# EAGLE design litterbox (EAGLE 9.5.2)
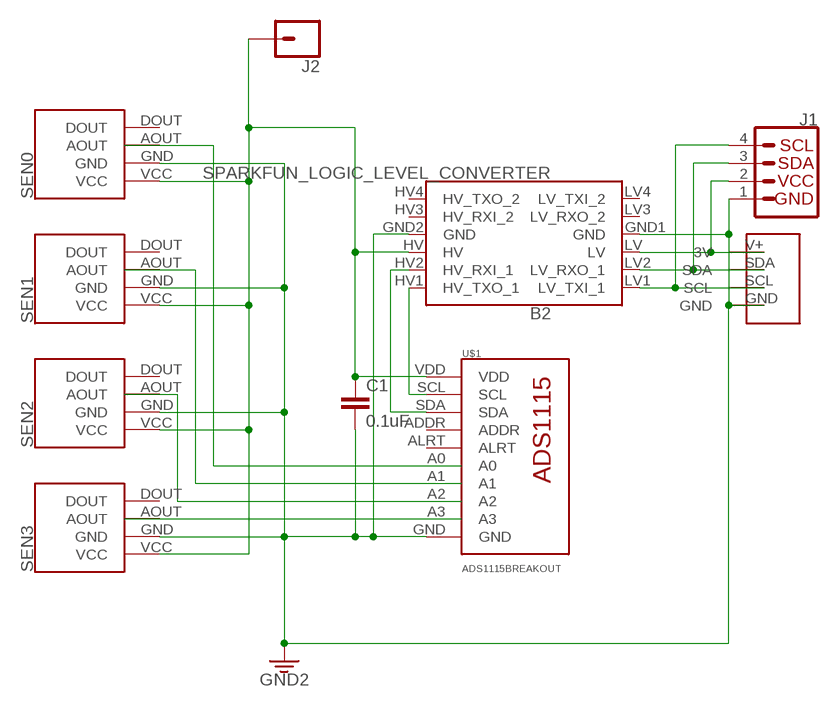
[diagram p0: schematic, sheet 1]

## Parts
B2  SPARKFUN_LOGIC_LEVEL_CONVERTER  [SPARKFUN_LOGIC_LEVEL_CONVERTER]
C1  0.1uF  0.1UF-KIT-EZ-50V-20%  [CAP-PTH-SMALL-KIT]
J1  QWIIC_CONNECTORJS-1MM  [1X04_1MM_RA]
J2  CONN_01  [1X01]
SEN0  MQ-SENSOR-BREAKOUT  [MQ-SENSOR-BREAKOUT]
SEN1  MQ-SENSOR-BREAKOUT  [MQ-SENSOR-BREAKOUT]
SEN2  MQ-SENSOR-BREAKOUT  [MQ-SENSOR-BREAKOUT]
SEN3  MQ-SENSOR-BREAKOUT  [MQ-SENSOR-BREAKOUT]
U$1  ADS1115BREAKOUT  [ADS1115BREAKOUT]
U$2  I2CHEADER  [I2CHEADER]

## Nets
3V3 [Power]: B2.LV J1.2(VCC) U$2.V+(3V)
5V [Power]: B2.HV C1.1 J2.1 SEN0.VCC SEN1.VCC SEN2.VCC SEN3.VCC U$1.VDD
GND [Power]: B2.GND1(GND) B2.GND2(GND) C1.2 J1.1(GND) SEN0.GND SEN1.GND SEN2.GND SEN3.GND U$1.GND U$2.GND ; supply symbol labelled GND2
N$9: B2.HV2(HV_RXI_1) U$1.SDA
N$11: B2.LV1(LV_TXI_1) J1.4(SCL) U$2.SCL
N$12: B2.HV1(HV_TXO_1) U$1.SCL
N$13: B2.LV2(LV_RXO_1) J1.3(SDA) U$2.SDA
SEN0A: SEN3.AOUT U$1.A3
SEN1A: SEN2.AOUT U$1.A2
SEN3A: SEN1.AOUT U$1.A1
SEN4A: SEN0.AOUT U$1.A0
Unconnected: B2.HV3(HV_RXI_2) B2.HV4(HV_TXO_2) B2.LV3(LV_RXO_2) B2.LV4(LV_TXI_2) SEN0.DOUT SEN1.DOUT SEN2.DOUT SEN3.DOUT U$1.ADDR U$1.ALRT

## Library data of the parts
B2 = SparkFun-Boards:SPARKFUN_LOGIC_LEVEL_CONVERTER: SparkFun Logic Level Converter -Bi-Directional This is the mechnical outline for the 3.3V - 5V bi directional logic level converter. *Note, the "LOCK" Package has the header pins staggered by an offset of 5 mils (off center line), so that when you slide a row of standard 0.1" headers into the PTH pads, it will hold position vertically. See the follwing turorial for more information on this type of special footprints: Sneaky Footprints <https://www.sparkfun.com/tutorials/114> SparkFun Products: SparkFun Logic Level Converter - Bi-Directional <https://www.sparkfun.com/products/12009>
C1 = SparkFun-Capacitors:0.1UF: 0.1µF ceramic capacitors A capacitor is a passive two-terminal electrical component used to store electrical energy temporarily in an electric field.; PROD_ID: CAP-08370
J1 = SparkFun-Connectors:QWIIC_CONNECTOR: SparkFun I2C Standard Qwiic Connector An SMD 1mm pitch JST connector makes it easy and quick (get it? Qwiic?) to connect I2C devices to each other. The Qwiic system <http://www.sparkfun.com/qwiic> enables fast and solderless connection between popular platforms and various sensors and actuators. We carry 200mm <https://www.sparkfun.com/products/14204>, 100mm <https://www.sparkfun.com/products/14205>, 50mm <https://www.sparkfun.com/products/14206>, and breadboard friendly <https://www.sparkfun.com/products/14207> Qwiic cables. We also offer 10 pcs strips <https://www.sparkfun.com/products/14323> the SMD connectors.
J2 = SparkFun-Connectors:CONN_01: Single connection point. Often used as Generic Header-pin footprint for 0.1 inch spaced/style header connections On any of the 0.1 inch spaced packages, you can populate with these: Break Away Headers - Straight <https://www.sparkfun.com/products/116> (PRT-00116) Break Away Male Headers - Right Angle <https://www.sparkfun.com/products/553> (PRT-00553) Female Headers <https://www.sparkfun.com/products/115> (PRT-00115) Break Away Headers - Machine Pin <https://www.sparkfun.com/products/117> (PRT-00117) Break Away Female Headers - Swiss Machine Pin <https://www.sparkfun.com/products/743> (PRT-00743) This device is also useful as a general connection point to wire up your design to another part of your project. Our various solder wires solder well into these plated through hole pads. Hook-Up Wire - Assortment (Stranded, 22 AWG) <https://www.sparkfun.com/products/11375> (PRT-11375) Hook-Up Wire - Assortment (Solid Core, 22 AWG) <https://www.sparkfun.com/products/11367> (PRT-11367) View the entire wire category on our website here <https://www.sparkfun.com/categories/141> Special notes: SMTSO-256-ET is a "flush mount" nut for a 4-40 screw. We mostly use this on specialty testbeds; it is a nice way to connect hardware to your PCB at an adjustable hieght. Also note, the SNAP packages are for using a snappable style connector. We sell a baggie of snaps and they are also used on two LilyPad designs: Snap Assortment - 30 pack (male and female) <https://www.sparkfun.com/products/11347> (DEV-11347) LilyPad Arduino SimpleSnap <https://www.sparkfun.com/products/10941> (DEV-10941) LilyPad SimpleSnap Protoboard <https://www.sparkfun.com/products/10940> (DEV-10940)
SEN0 SEN1-SEN3 = LOLIN32:MQ-SENSOR-BREAKOUT: MQ-series gas sensor breakout board. Pinout may vary.
U$1 = LOLIN32:ADS1115BREAKOUT: ADS1115 I2C 4 channel ADC
U$2 = LOLIN32:I2CHEADER

## Board
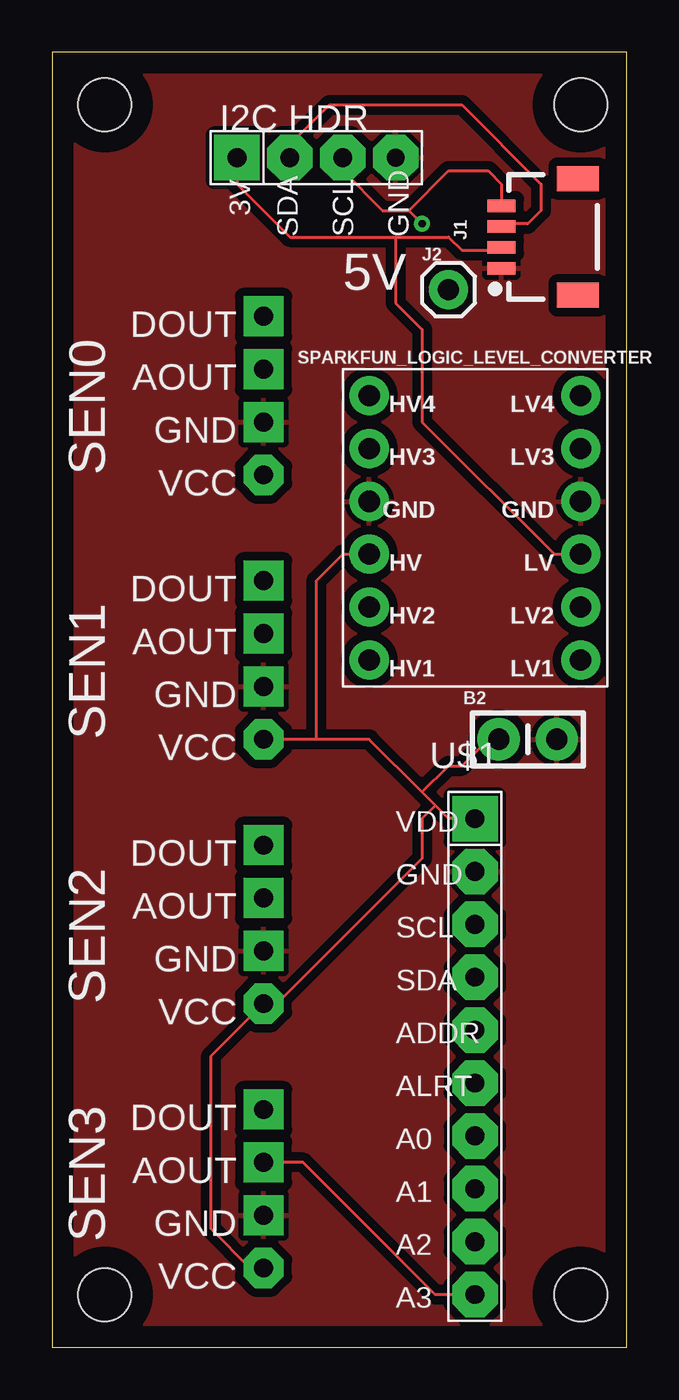
[diagram p1: board, top side]
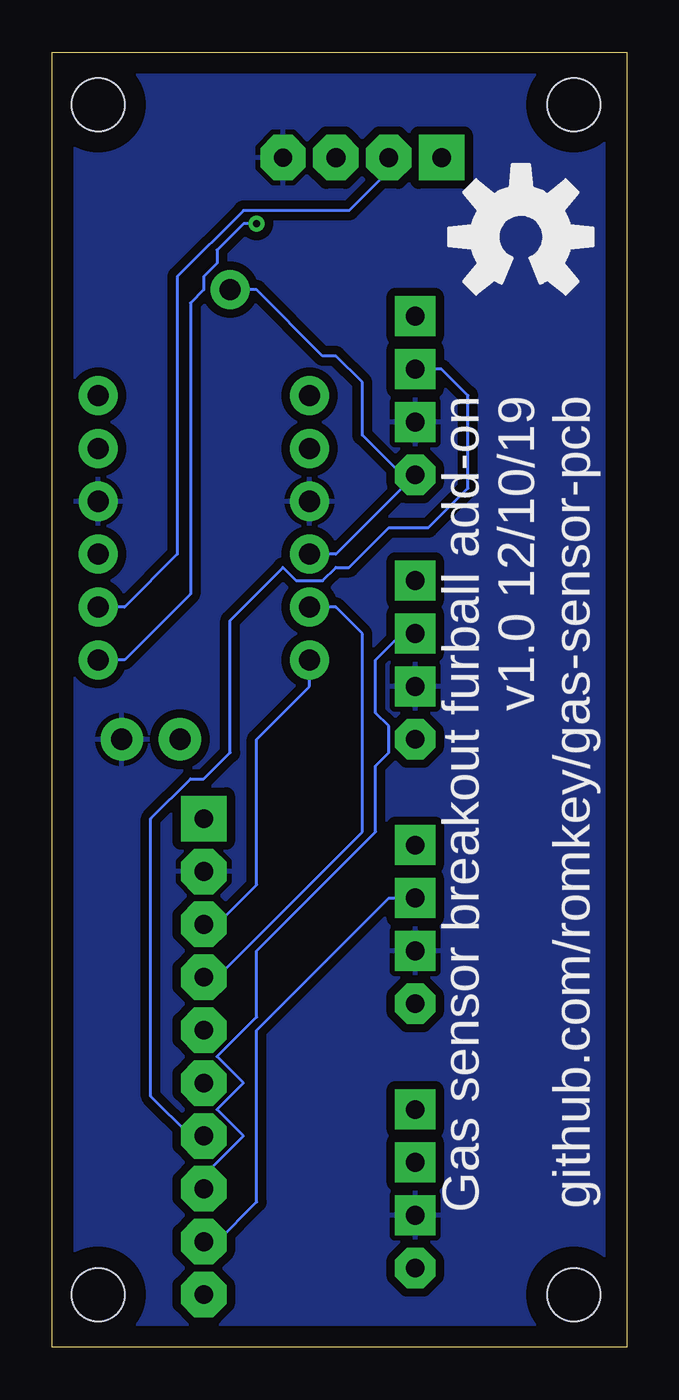
[diagram p2: board, bottom side, seen from below]

Size 27.61 x 62.22 mm. Coordinates in mm from the lower left corner, seen from the top.
Outline: 0,0 27.61,0 27.61,62.22 0,62.22 0,0
Copper layers (1*16): Top 0.035mm / dielectric 1.5mm / Bottom 0.035mm
Design rules "default": minimum track width 6mil, minimum drill 0.35mm, track to track 6mil, track to pad 6mil, pad to pad 6mil, via to via 6mil, smd to smd 6mil, copper to edge 40mil, drill to drill 6mil, minimum pad ring 10mil, minimum via ring 8mil, stop-mask expansion 4mil, vias tented up to drill 0mil, thermal gap 10mil
Holes 2.54 mm at 2.54,2.54 2.54,59.69 25.4,2.54 25.4,59.69

### Footprints (pad centres in the part's own frame; a part is rotated, then mirrored left to right if it is on the bottom)
SPARKFUN_LOGIC_LEVEL_CONVERTER = drill 1.016 pad 1.88: GND1 -5.08,-1.27; GND2 5.08,-1.27; HV 5.08,1.27; HV1 5.08,6.35; HV2 5.08,3.81; HV3 5.08,-3.81; HV4 5.08,-6.35; LV -5.08,1.27; LV1 -5.08,6.35; LV2 -5.08,3.81; LV3 -5.08,-3.81; LV4 -5.08,-6.35
CAP-PTH-SMALL-KIT = drill 1.016 pad 2.032: 1 -1.397,0; 2 1.397,0
1X04_1MM_RA = smd 0.6 x 1.35: 1 -1.5,0; 2 -0.5,0; 3 0.5,0; 4 1.5,0 | smd 1.2 x 2: NC1 2.8,-3.675; NC2 -2.8,-3.675
1X01 = drill 1.016 pad 1.88: 1 0,0
MQ-SENSOR-BREAKOUT = drill 0.9 pad 1.93 square: AOUT 6.35,1.27; DOUT 8.89,1.27; GND 3.81,1.27 | drill 0.9 pad 1.93 octagon: VCC 1.27,1.27
ADS1115BREAKOUT = drill 0.9 pad 2.184 octagon: A0 2.54,11.43; A1 2.54,8.89; A2 2.54,6.35; A3 2.54,3.81; ADDR 2.54,16.51; ALRT 2.54,13.97; GND 2.54,24.13; SCL 2.54,21.59; SDA 2.54,19.05 | drill 0.9 pad 2.184 square: VDD 2.54,26.67
I2CHEADER = drill 0.85 pad 2.184 octagon: GND 3.81,1.27 | drill 0.9 pad 2.184 octagon: SCL 3.81,3.81; SDA 3.81,6.35 | drill 0.9 pad 2.184 square: V+ 3.81,8.89

### Placement (x,y rotation side)
B2  20.32,39.37 180 top
C1  22.86,29.21 0 top
J1  21.59,53.34 90 top
J2  19.05,50.8 0 top
SEN0  11.43,40.64 90 top
SEN1  11.43,27.94 90 top
SEN2  11.43,15.24 90 top
SEN3  11.43,2.54 90 top
U$1  17.78,-1.27 0 top
U$2  17.78,53.34 90 top
U$3  [OSHW-LOGO-L]  5.08,53.34 0 bottom

### Tracks (layer width: path | path; a pad name or v marks a point on that pad's centre or on a via)
3V3
  Top 0.152: 16.51,53.34 11.43,53.34 8.89,55.88 U$2.V+ | 16.51,53.34 19.05,53.34 19.69,52.7 21.59,52.7 J1.2 | B2.LV 24.13,38.1 17.78,44.45 17.78,48.89 16.51,50.16 16.51,53.34
5V
  Top 0.152: SEN3.VCC 9.53,3.81 7.62,5.71 7.62,13.97 9.53,15.87 9.53,16.51 SEN2.VCC 10.79,16.51 17.78,23.5 17.78,25.4 18.41,26.04 | 12.7,29.21 15.24,29.21 17.78,26.67 | 12.7,29.21 SEN1.VCC | 18.41,26.04 19.05,25.4 U$1.VDD | 18.41,26.04 17.78,26.67 | 17.78,26.67 19.05,27.94 19.69,27.94 20.95,29.21 C1.1 | B2.HV 13.97,38.1 12.7,36.83 12.7,29.21
  Bottom 0.152: B2.HV 13.97,38.1 10.79,41.27 10.16,41.27 | J2.1 17.78,50.8 14.6,47.62 13.97,47.62 12.7,46.35 12.7,43.81 10.16,41.27 | 10.16,41.27 SEN0.VCC
GND
  pour Top (isolate 0.406): 0,62.23 0,0 27.94,0 27.94,62.23
  pour Bottom (isolate 0.406): 0,62.23 0,0 27.94,0 27.94,62.23
N$9
  Bottom 0.152: B2.HV2 13.97,35.56 12.7,34.29 12.7,24.77 19.69,17.78 U$1.SDA
N$11  (via drill 0.35)
  Top 0.152: 17.14,54.61 19.05,56.52 20.95,56.52 21.59,55.88 J1.4 21.59,54.61 | 17.14,54.61 15.87,54.61 13.97,56.52 U$2.SCL | 17.14,54.61 v17.78,53.97
  Bottom 0.152: B2.LV1 24.13,33.02 20.95,36.2 20.95,50.16 20.32,50.8 20.32,51.43 19.69,52.07 19.69,52.7 18.41,53.97 v17.78,53.97
N$12
  Bottom 0.152: B2.HV1 15.24,31.75 17.78,29.21 17.78,22.23 19.69,20.32 U$1.SCL
N$13
  Top 0.152: U$2.SDA 11.43,57.78 13.33,59.69 19.69,59.69 23.5,55.88 23.5,54.61 22.86,53.97 21.59,53.97 J1.3
  Bottom 0.152: B2.LV2 24.13,35.56 21.59,38.1 21.59,51.43 18.41,54.61 13.33,54.61 11.43,56.52 U$2.SDA
SEN0A
  Top 0.152: SEN3.AOUT 12.06,8.89 18.41,2.54 U$1.A3
SEN1A
  Bottom 0.152: SEN2.AOUT 11.43,21.59 17.78,15.24 17.78,6.98 19.69,5.08 U$1.A2
SEN3A
  Bottom 0.152: SEN1.AOUT 10.79,34.29 12.06,33.02 12.06,30.48 11.43,29.85 11.43,28.57 12.06,27.94 12.06,24.77 17.78,19.05 17.78,15.87 19.69,13.97 18.41,12.7 19.69,11.43 18.41,10.16 20.32,8.25 U$1.A1
SEN4A
  Bottom 0.152: SEN0.AOUT 8.89,46.99 7.62,45.72 7.62,41.27 9.53,39.37 11.43,39.37 13.33,37.46 13.97,37.46 14.6,36.83 15.87,36.83 16.51,37.46 19.05,34.92 19.05,28.57 20.32,27.3 20.95,27.3 22.86,25.4 22.86,12.06 20.95,10.16 U$1.A0

### Text on the board
tPlace: 5V | SEN0 | SEN1 | SEN2 | SEN3
bPlace: Gas sensor breakout furball add-on / v1.0 12/10/19 / github.com/romkey/gas-sensor-pcb